# Altium schematic sheet STM32G4.SchDoc
size B; SheetNumber: 2; SheetTotal: 4
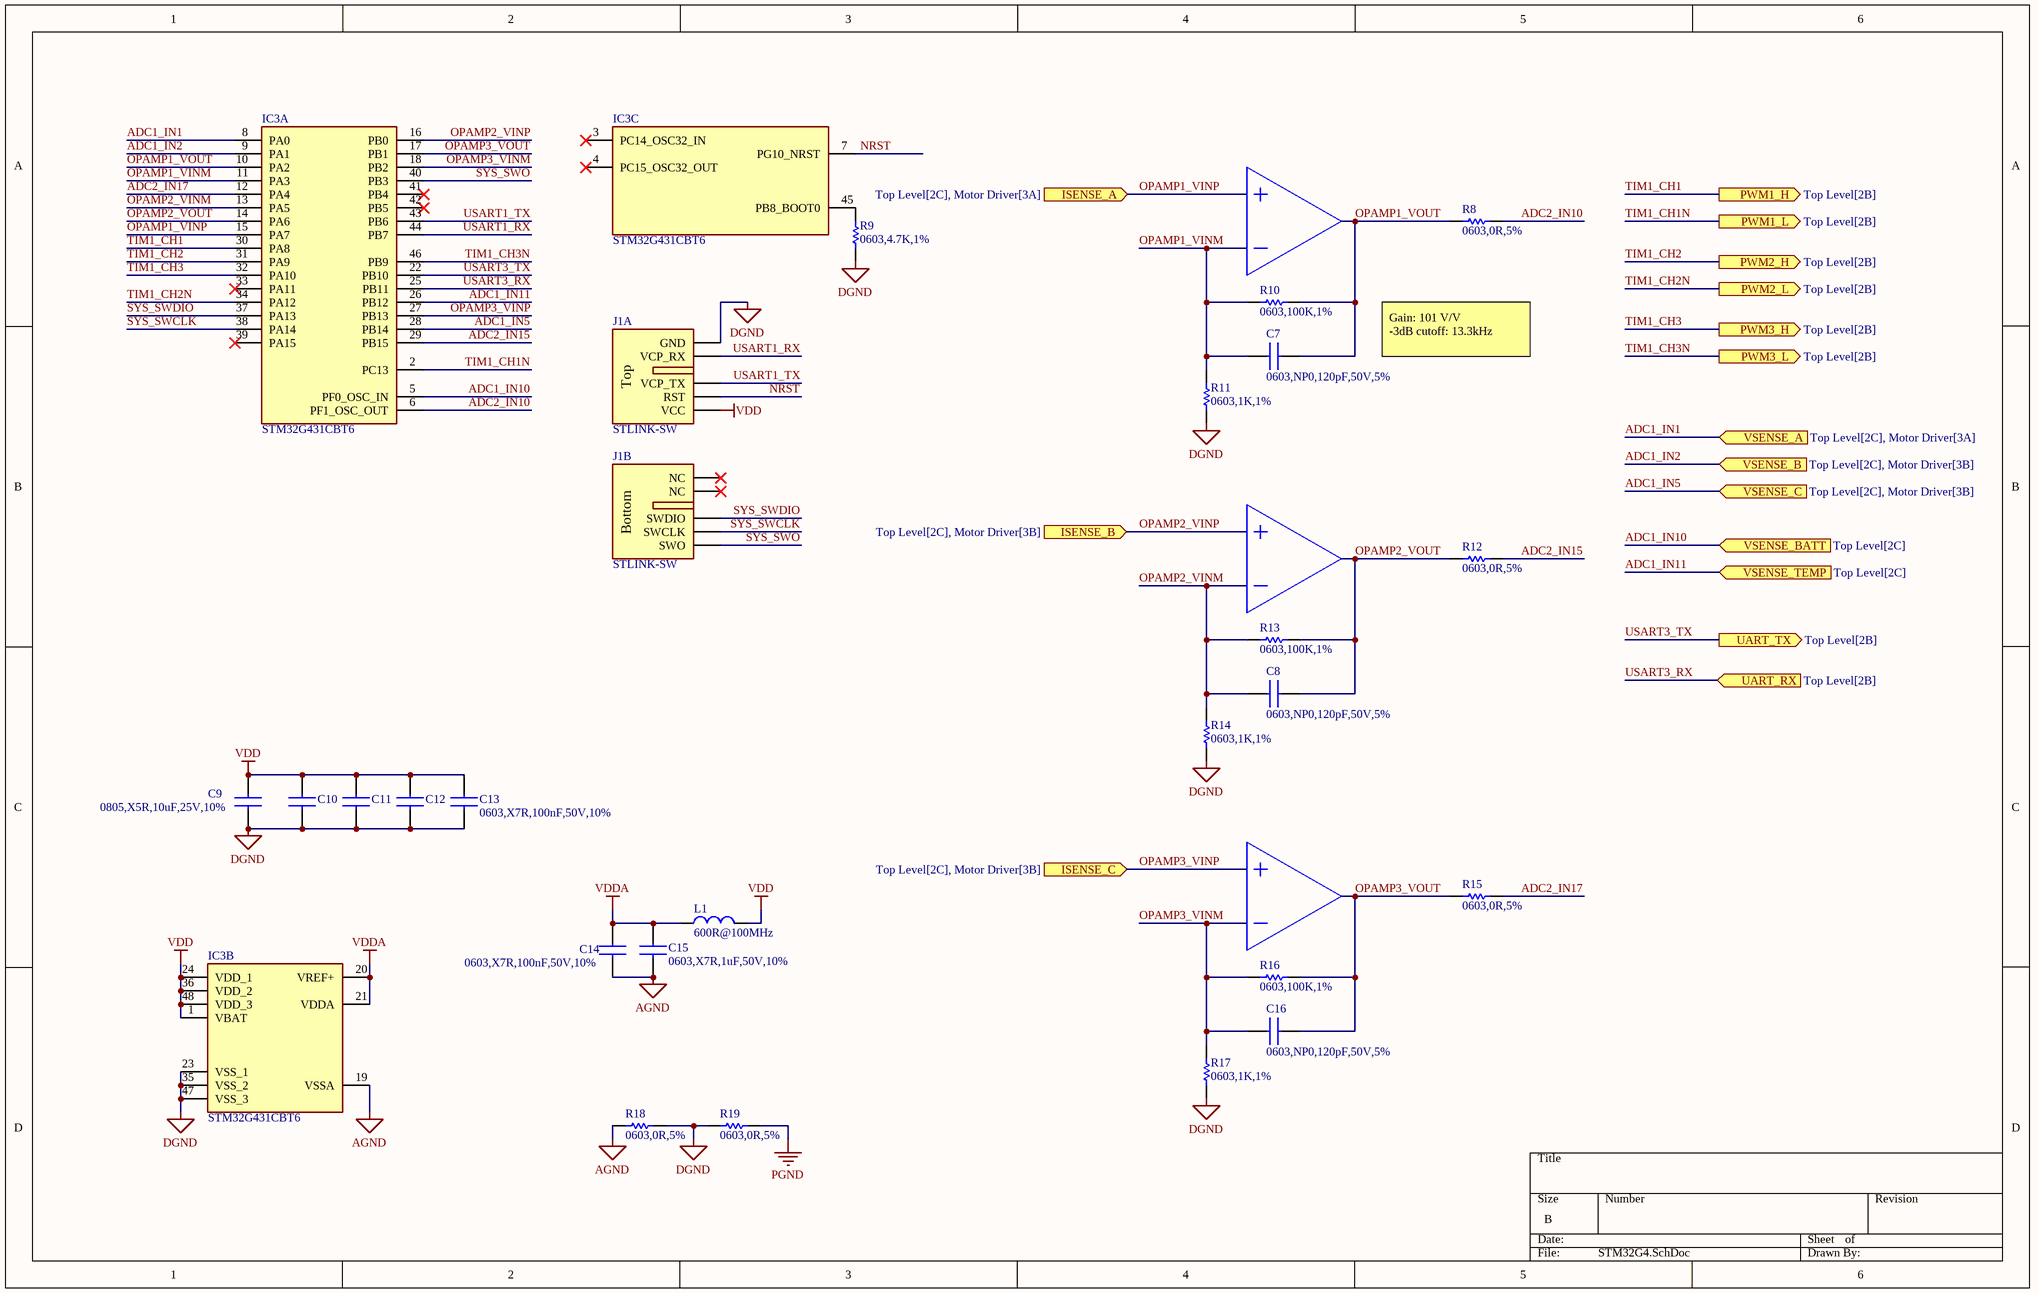
[diagram p0: STM32G4.SchDoc]

## Parts
C7  0603,NP0,120pF,50V,5%  [CAPC1608X90N]
C8  0603,NP0,120pF,50V,5%  [CAPC1608X90N]
C9  0805,X5R,10uF,25V,10%  [CAPC2012X145N]
C10  0603,X7R,100nF,50V,10%  [CAPC1608X90N]  (value not drawn)
C11  0603,X7R,100nF,50V,10%  [CAPC1608X90N]  (value not drawn)
C12  0603,X7R,100nF,50V,10%  [CAPC1608X90N]  (value not drawn)
C13  0603,X7R,100nF,50V,10%  [CAPC1608X90N]
C14  0603,X7R,100nF,50V,10%  [CAPC1608X90N]
C15  0603,X7R,1uF,50V,10%  [CAPC1608X90N]
C16  0603,NP0,120pF,50V,5%  [CAPC1608X90N]
IC3  STM32G431CBT6  [QFP50P900X900X160-48N]  (parts A,B,C of 3)
J1  STLINK-SW  [009159010061911]  (parts A,B of 2)  (no BOM)
L1  600R@100MHz  [L0603]
R8  0603,0R,5%  [RESC1608X55N]
R9  0603,4.7K,1%  [RESC1608X55N]
R10  0603,100K,1%  [RESC1608X55N]
R11  0603,1K,1%  [RESC1608X55N]
R12  0603,0R,5%  [RESC1608X55N]
R13  0603,100K,1%  [RESC1608X55N]
R14  0603,1K,1%  [RESC1608X55N]
R15  0603,0R,5%  [RESC1608X55N]
R16  0603,100K,1%  [RESC1608X55N]
R17  0603,1K,1%  [RESC1608X55N]
R18  0603,0R,5%  [RESC1608X55N]
R19  0603,0R,5%  [RESC1608X55N]

## Ports
ISENSE_A (in, see Top Level[2C], Motor Driver[3A]), ISENSE_B (in, see Top Level[2C], Motor Driver[3B]), ISENSE_C (in, see Top Level[2C], Motor Driver[3B]), PWM1_H (out, see Top Level[2B]), PWM1_L (out, see Top Level[2B]), PWM2_H (out, see Top Level[2B]), PWM2_L (out, see Top Level[2B]), PWM3_H (out, see Top Level[2B]), PWM3_L (out, see Top Level[2B]), UART_RX (in, see Top Level[2B]), UART_TX (out, see Top Level[2B]), VSENSE_A (in, see Top Level[2C], Motor Driver[3A]), VSENSE_B (in, see Top Level[2C], Motor Driver[3B]), VSENSE_BATT (in, see Top Level[2C]), VSENSE_C (in, see Top Level[2C], Motor Driver[3B]), VSENSE_TEMP (in, see Top Level[2C])

## Nets
AGND: C14.1 C15.1 IC3.19(VSSA) R18.1
DGND: C9.1 C10.1 C11.1 C12.1 C13.1 IC3.23(VSS_1) IC3.35(VSS_2) IC3.47(VSS_3) J1.1(GND) R9.1 R11.1 R14.1 R17.1 R18.2 R19.1
PGND: R19.2
VDD: C9.2 C10.2 C11.2 C12.2 C13.2 IC3.1(VBAT) IC3.24(VDD_1) IC3.36(VDD_2) IC3.48(VDD_3) J1.5(VCC) L1.2
VDDA: C14.2 C15.2 IC3.20(VREF+) IC3.21(VDDA) L1.1
ADC1_IN1: IC3.8(PA0) ; port VSENSE_A
ADC1_IN2: IC3.9(PA1) ; port VSENSE_B
ADC1_IN5: IC3.28(PB14) ; port VSENSE_C
ADC1_IN10: IC3.5(PF0_OSC_IN) ; port VSENSE_BATT
ADC1_IN11: IC3.26(PB12) ; port VSENSE_TEMP
ADC2_IN10: IC3.6(PF1_OSC_OUT) R8.2
ADC2_IN15: IC3.29(PB15) R12.2
ADC2_IN17: IC3.12(PA4) R15.2
NRST: IC3.7(PG10_NRST) J1.4(RST)
OPAMP1_VINM: C7.1 IC3.11(PA3) R10.1 R11.2
OPAMP1_VINP: IC3.15(PA7) ; port ISENSE_A
OPAMP1_VOUT: C7.2 IC3.10(PA2) R8.1 R10.2
OPAMP2_VINM: C8.1 IC3.13(PA5) R13.1 R14.2
OPAMP2_VINP: IC3.16(PB0) ; port ISENSE_B
OPAMP2_VOUT: C8.2 IC3.14(PA6) R12.1 R13.2
OPAMP3_VINM: C16.1 IC3.18(PB2) R16.1 R17.2
OPAMP3_VINP: IC3.27(PB13) ; port ISENSE_C
OPAMP3_VOUT: C16.2 IC3.17(PB1) R15.1 R16.2
SYS_SWCLK: IC3.38(PA14) J1.9(SWCLK)
SYS_SWDIO: IC3.37(PA13) J1.8(SWDIO)
SYS_SWO: IC3.40(PB3) J1.10(SWO)
TIM1_CH1: IC3.30(PA8) ; port PWM1_H
TIM1_CH1N: IC3.2(PC13) ; port PWM1_L
TIM1_CH2: IC3.31(PA9) ; port PWM2_H
TIM1_CH2N: IC3.34(PA12) ; port PWM2_L
TIM1_CH3: IC3.32(PA10) ; port PWM3_H
TIM1_CH3N: IC3.46(PB9) ; port PWM3_L
USART1_RX: IC3.44(PB7) J1.2(VCP_RX)
USART1_TX: IC3.43(PB6) J1.3(VCP_TX)
USART3_RX: IC3.25(PB11) ; port UART_RX
USART3_TX: IC3.22(PB10) ; port UART_TX
NetIC3_45: IC3.45(PB8_BOOT0) R9.2

Not connected (* = marked no-connect by the designer): IC3 3(PC14_OSC32_IN)* 4(PC15_OSC32_OUT)* 33(PA11)* 39(PA15)* 41(PB4)* 42(PB5)*; J1 6(NC)* 7(NC)*

## Notes on the sheet
- Gain: 101 V/V
  -3dB cutoff: 13.3kHz
- (in symbol STLINK-SW, part A) Top
- (in symbol STLINK-SW, part B) Bottom

## Library data of the parts
C7 C8 C16 = CC0603JRNPO9BN121: 50V 120pF NP0 ±5% 0603 Multilayer Ceramic Capacitors MLCC - SMD/SMT ROHS; Manufacturer_Name: YAGEO; Datasheet Link: https://componentsearchengine.com/Datasheets/2/CC0603KRX7R9BB104.pdf; Height: 0.9mm; Manufacturer_Part_Number: CC0603JRNPO9BN121; Mouser Part Number: 603-CC603KRX7R9BB104; Mouser Price/Stock: https://www.mouser.co.uk/ProductDetail/YAGEO/CC0603KRX7R9BB104?qs=vTakOoo5QyLvVCYM2ge8LQ%3D%3D; Arrow Part Number: CC0603KRX7R9BB104; Arrow Price/Stock: https://www.arrow.com/en/products/cc0603krx7r9bb104/yageo?utm_currency=USD&region=europe; LCSC Part #: C107035
C9 = CC0805KKX5R8BB106: 10 µF ±10% 25V Ceramic Capacitor X5R 0805 (2012 Metric); Manufacturer_Name: YAGEO; Datasheet Link: https://www.yageo.com/upload/media/product/productsearch/datasheet/mlcc/UPY-GPHC_X5R_4V-to-50V_27.pdf; Height: 1.45mm; Manufacturer_Part_Number: CC0805KKX5R8BB106; Mouser Part Number: 603-CC805KKX5R8BB106; Mouser Price/Stock: https://www.mouser.co.uk/ProductDetail/YAGEO/CC0805KKX5R8BB106?qs=57cj7OiSijm89pM64t1AGQ%3D%3D; Arrow Part Number: CC0805KKX5R8BB106; Arrow Price/Stock: https://www.arrow.com/en/products/cc0805kkx5r8bb106/yageo?utm_currency=USD&region=nac; LCSC Part #: C89831
C10-C14 = CC0603KRX7R9BB104: 50V 100nF X7R ±10% 0603 Multilayer Ceramic Capacitors MLCC - SMD/SMT ROHS; Manufacturer_Name: YAGEO; Datasheet Link: https://componentsearchengine.com/Datasheets/2/CC0603KRX7R9BB104.pdf; Height: 0.9mm; Manufacturer_Part_Number: CC0603KRX7R9BB104; Mouser Part Number: 603-CC603KRX7R9BB104; Mouser Price/Stock: https://www.mouser.co.uk/ProductDetail/YAGEO/CC0603KRX7R9BB104?qs=vTakOoo5QyLvVCYM2ge8LQ%3D%3D; Arrow Part Number: CC0603KRX7R9BB104; Arrow Price/Stock: https://www.arrow.com/en/products/cc0603krx7r9bb104/yageo?utm_currency=USD&region=europe; LCSC Part #: C14663
C15 = CC0603KRX7R9BB105: 50V 1uF X7R ±10% 0603 Multilayer Ceramic Capacitors MLCC - SMD/SMT ROHS; Manufacturer_Name: YAGEO; Datasheet Link: https://www.yageo.com/upload/media/product/app/datasheet/mlcc/upy-gphc_x7r_6_3v-to-250v.pdf; Height: 0.95mm; Manufacturer_Part_Number: CC0603KRX7R9BB105; Mouser Part Number: 603-CC603KRX7R9BB105; Mouser Price/Stock: https://www.mouser.co.uk/ProductDetail/YAGEO/CC0603KRX7R9BB105?qs=6wERJjOp3mmF17%252BYi8cgJQ%3D%3D; Arrow Part Number: CC0603KRX7R9BB105; Arrow Price/Stock: https://www.arrow.com/en/products/cc0603krx7r9bb105/yageo?utm_currency=USD&region=nac; LCSC Part #: C559769
IC3 = STM32G431CBT6: Arm Cortex-M4 32-bit MCU+FPU, 170 MHz / 213 DMIPS, up to 128 KB Flash, 32 KB SRAM, rich analog, math accelerator; Manufacturer_Name: STMicroelectronics; Datasheet Link: https://www.st.com/resource/en/datasheet/stm32g431cb.pdf; Height: 1.6mm; Manufacturer_Part_Number: STM32G431CBT6; Mouser Part Number: 511-STM32G431CBT6; Mouser Price/Stock: https://www.mouser.co.uk/ProductDetail/STMicroelectronics/STM32G431CBT6?qs=T3oQrply3y8OocyGDXq5wg%3D%3D; Arrow Part Number: STM32G431CBT6; Arrow Price/Stock: https://www.arrow.com/en/products/stm32g431cbt6/stmicroelectronics?utm_currency=USD&region=nac; LCSC Part #: C529355
J1 = STLINK-SW: SSL Connector 10 Position Adapter, Bridge Board to Board - Card Edge 0.079" (2.00mm)
L1 = BLM18AG601SN1D: 380mΩ ±25% 600Ω@100MHz 0603 Ferrite Beads ROHS; LCSC Part #: C19330
R8 R12 R15 R18 R19 = RC0603JR-070RL: 100mW Thick Film Resistor 75V ±5% 0Ω 0603 Chip Resistor - Surface Mount ROHS; Manufacturer_Name: YAGEO; Datasheet Link: https://www.mouser.com/catalog/specsheets/YAGEO_PYu_RC_Group_51_RoHS_L_12.pdf; Height: 0.55mm; Manufacturer_Part_Number: RC0603JR-070RL; LCSC Part #: C95177
R9 = RC0603FR-074K7L: 100mW Thick Film Resistor 75V ±100ppm/℃ ±1% 4.7kΩ 0603 Chip Resistor - Surface Mount ROHS; Manufacturer_Name: YAGEO; Datasheet Link: https://www.mouser.com/catalog/specsheets/YAGEO_PYu_RC_Group_51_RoHS_L_12.pdf; Height: 0.55mm; Manufacturer_Part_Number: RC0603FR-074K7L; LCSC Part #: C99782
R10 R13 R16 = RC0603FR-07100KL: 100mW Thick Film Resistor 75V ±100ppm/℃ ±1% 100kΩ 0603 Chip Resistor - Surface Mount ROHS; Manufacturer_Name: YAGEO; Datasheet Link: https://www.mouser.com/catalog/specsheets/YAGEO_PYu_RC_Group_51_RoHS_L_12.pdf; Height: 0.55mm; Manufacturer_Part_Number: RC0603FR-07100KL; LCSC Part #: C14675
R11 R14 R17 = RC0603FR-071KL: 100mW Thick Film Resistor 75V ±100ppm/℃ ±1% 1kΩ 0603 Chip Resistor - Surface Mount ROHS; Manufacturer_Name: YAGEO; Datasheet Link: https://www.mouser.com/catalog/specsheets/YAGEO_PYu_RC_Group_51_RoHS_L_12.pdf; Height: 0.55mm; Manufacturer_Part_Number: RC0603FR-071KL; LCSC Part #: C22548